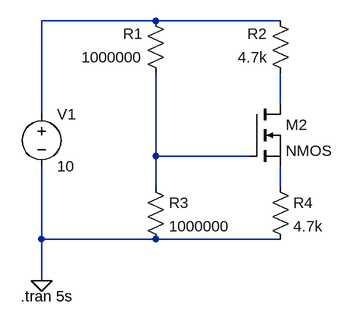
[diagram p0: schematic nmos_lab2.asc]
nmos_lab2.asc, the LTspice schematic file:
Version 4.1
SHEET 1 880 680
WIRE 192 -48 16 -48
WIRE 384 -48 192 -48
WIRE 384 80 384 32
WIRE 16 96 16 -48
WIRE 192 160 192 32
WIRE 336 160 192 160
WIRE 192 208 192 160
WIRE 384 208 384 176
WIRE 16 288 16 176
WIRE 192 288 16 288
WIRE 384 288 192 288
WIRE 16 352 16 288
FLAG 16 352 0
SYMBOL voltage 16 80 R0
WINDOW 123 0 0 Left 0
WINDOW 39 0 0 Left 0
SYMATTR InstName V1
SYMATTR Value 10
SYMBOL res 208 48 R180
WINDOW 0 36 76 Left 2
WINDOW 3 36 40 Left 2
SYMATTR InstName R1
SYMATTR Value 1000000
SYMBOL res 400 48 R180
WINDOW 0 36 76 Left 2
WINDOW 3 36 40 Left 2
SYMATTR InstName R2
SYMATTR Value 4.7k
SYMBOL res 176 192 R0
SYMATTR InstName R3
SYMATTR Value 1000000
SYMBOL res 368 192 R0
SYMATTR InstName R4
SYMATTR Value 4.7k
SYMBOL nmos 336 80 R0
SYMATTR InstName M2
TEXT -16 376 Left 2 !.tran 5s

The netlist it stands for:
* nmos_lab2.asc
V1 N001 0 10
R1 N003 N001 1000000
R2 N002 N001 4.7k
R3 N003 0 1000000
R4 N004 0 4.7k
M2 N002 N003 N004 N004 NMOS
.model NMOS NMOS
.model PMOS PMOS
.lib standard.mos
.tran 5s
.backanno
.end